# Altium schematic sheet CAN.SchDoc
size A4
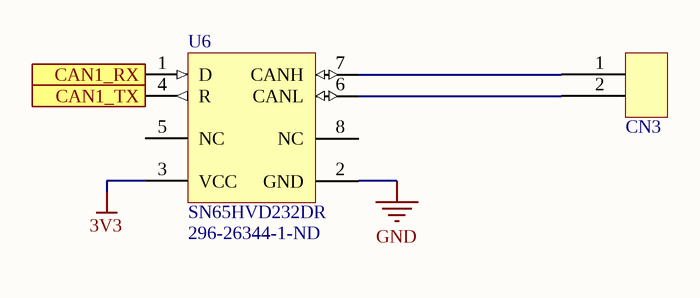
[diagram p0: CAN.SchDoc]

## Parts
CN3  640456-2  [640456-2]  (value not drawn)
U6  SN65HVD232DR  Supplier Part Number 1: 296-26344-1-ND  [8-SOIC]

## Ports
CAN1_RX, CAN1_TX

## Nets
3V3: U6.3(VCC)
GND: U6.2(GND)
CAN1_RX: U6.1(D) ; port CAN1_RX
CAN1_TX: U6.4(R) ; port CAN1_TX
NetCN3_1: CN3.1 U6.7(CANH)
NetCN3_2: CN3.2 U6.6(CANL)

Not connected (* = marked no-connect by the designer): U6 5(NC) 8(NC)

## Library data of the parts
CN3 = 2x1 Male Header, Friction Lock: CONN HEADER VERT 2POS .100 TIN; Made by: Robert Keen; ComponentLink1Description: Digikey; ComponentLink1URL: https://www.digikey.ca/product-detail/en/te-connectivity-amp-connectors/640456-2/A1921-ND/109003; Made on: 2018-08-15; Supplier 1: Digi-Key; Supplier Part Number 1: A1921-ND
U6 = CAN Half Duplex SN65HVD232DR: IC CAN TRANSCEIVER 3.3V 8-SOIC; Made by: Robert Keen; ComponentLink1Description: Digikey; ComponentLink1URL: https://www.digikey.ca/product-detail/en/texas-instruments/SN65HVD232DR/296-26344-1-ND/2254978; Supplier 1: Digi-Key; Made on: 2018-08-14